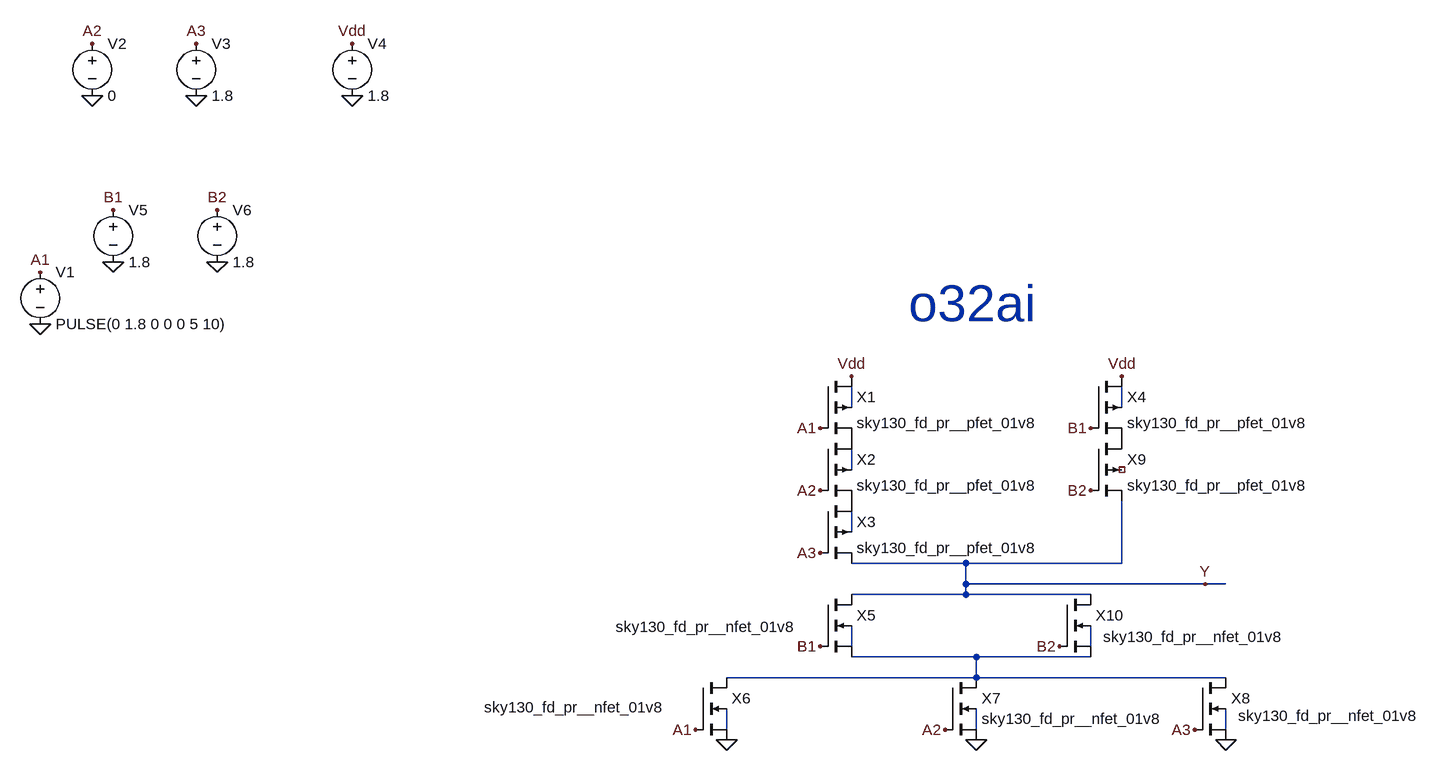
[diagram p0: schematic o32ai.asc]
o32ai.asc, the LTspice schematic file:
Version 4
SHEET 1 1520 892
WIRE 560 320 560 288
WIRE 976 320 976 288
WIRE 560 416 560 384
WIRE 560 512 560 480
WIRE 736 560 560 560
WIRE 976 560 976 464
WIRE 976 560 736 560
WIRE 736 592 736 560
WIRE 1104 592 736 592
WIRE 1136 592 1104 592
WIRE 736 608 736 592
WIRE 736 608 560 608
WIRE 928 608 736 608
WIRE 560 688 560 656
WIRE 928 688 928 656
WIRE 752 704 560 704
WIRE 928 704 752 704
WIRE 752 736 752 704
WIRE 752 736 368 736
WIRE 1136 736 752 736
WIRE 368 816 368 784
WIRE 752 816 752 784
WIRE 1136 816 1136 784
FLAG 560 272 Vdd
FLAG -688 192 0
FLAG -608 -160 0
FLAG -448 -160 0
FLAG -688 112 A1
FLAG -608 -240 A2
FLAG -448 -240 A3
FLAG -208 -240 Vdd
FLAG -208 -160 0
FLAG -576 96 0
FLAG -576 16 B1
FLAG 512 352 A1
FLAG 512 448 A2
FLAG 512 544 A3
FLAG 368 832 0
FLAG 752 832 0
FLAG 1136 832 0
FLAG 320 816 A1
FLAG 704 816 A2
FLAG 1088 816 A3
FLAG 928 352 B1
FLAG 976 272 Vdd
FLAG -416 96 0
FLAG -416 16 B2
FLAG 928 448 B2
FLAG 512 688 B1
FLAG 880 688 B2
FLAG 1104 592 Y
SYMBOL pmos4 512 272 R0
SYMATTR InstName X1
SYMATTR Value2 l=0.13u w=4u
SYMATTR Value sky130_fd_pr__pfet_01v8
SYMBOL pmos4 512 368 R0
SYMATTR InstName X2
SYMATTR Value2 l=0.13u w=4u
SYMATTR Value sky130_fd_pr__pfet_01v8
SYMBOL pmos4 512 464 R0
SYMATTR InstName X3
SYMATTR Value2 l=0.13u w=4u
SYMATTR Value sky130_fd_pr__pfet_01v8
SYMBOL pmos4 928 272 R0
SYMATTR InstName X4
SYMATTR Value2 l=0.13u w=4u
SYMATTR Value sky130_fd_pr__pfet_01v8
SYMBOL voltage -688 96 R0
WINDOW 123 0 0 Left 0
WINDOW 39 0 0 Left 0
SYMATTR InstName V1
SYMATTR Value PULSE(0 1.8 0 0 0 5 10)
SYMBOL voltage -608 -256 R0
WINDOW 123 0 0 Left 0
WINDOW 39 0 0 Left 0
SYMATTR InstName V2
SYMATTR Value 0
SYMBOL voltage -448 -256 R0
WINDOW 123 0 0 Left 0
WINDOW 39 0 0 Left 0
SYMATTR InstName V3
SYMATTR Value 1.8
SYMBOL voltage -208 -256 R0
WINDOW 123 0 0 Left 0
WINDOW 39 0 0 Left 0
SYMATTR InstName V4
SYMATTR Value 1.8
SYMBOL voltage -576 0 R0
WINDOW 123 0 0 Left 0
WINDOW 39 0 0 Left 0
SYMATTR InstName V5
SYMATTR Value 1.8
SYMBOL nmos4 320 736 R0
WINDOW 3 -325 46 Left 2
SYMATTR InstName X6
SYMATTR Value2 l=0.13u w=2u
SYMATTR Value sky130_fd_pr__nfet_01v8
SYMBOL nmos4 704 736 R0
WINDOW 3 56 63 Left 2
SYMATTR InstName X7
SYMATTR Value2 l=0.13u w=2u
SYMATTR Value sky130_fd_pr__nfet_01v8
SYMBOL nmos4 1088 736 R0
WINDOW 3 67 59 Left 2
SYMATTR InstName X8
SYMATTR Value2 l=0.13u w=2u
SYMATTR Value sky130_fd_pr__nfet_01v8
SYMBOL pmos4 928 368 R0
SYMATTR InstName X9
SYMATTR Value2 l=0.13u w=4u
SYMATTR Value sky130_fd_pr__pfet_01v8
SYMBOL voltage -416 0 R0
WINDOW 123 0 0 Left 0
WINDOW 39 0 0 Left 0
SYMATTR InstName V6
SYMATTR Value 1.8
SYMBOL nmos4 512 608 R0
WINDOW 3 -315 50 Left 2
SYMATTR InstName X5
SYMATTR Value2 l=0.13u w=2u
SYMATTR Value sky130_fd_pr__nfet_01v8
SYMBOL nmos4 880 608 R0
WINDOW 3 67 65 Left 2
SYMATTR InstName X10
SYMATTR Value2 l=0.13u w=2u
SYMATTR Value sky130_fd_pr__nfet_01v8
TEXT 648 160 Left 6 ;o32ai

The netlist it stands for:
* o32ai.asc
M§X1 Vdd A1 P001 N001 sky130_fd_pr__pfet_01v8 l=0.13u w=4u
M§X2 P001 A2 P002 N003 sky130_fd_pr__pfet_01v8 l=0.13u w=4u
M§X3 P002 A3 Y N004 sky130_fd_pr__pfet_01v8 l=0.13u w=4u
M§X4 Vdd B1 P003 N002 sky130_fd_pr__pfet_01v8 l=0.13u w=4u
V1 A1 0 PULSE(0 1.8 0 0 0 5 10)
V2 A2 0 0
V3 A3 0 1.8
V4 Vdd 0 1.8
V5 B1 0 1.8
M§X6 N007 A1 0 N008 sky130_fd_pr__nfet_01v8 l=0.13u w=2u
M§X7 N007 A2 0 N009 sky130_fd_pr__nfet_01v8 l=0.13u w=2u
M§X8 N007 A3 0 N010 sky130_fd_pr__nfet_01v8 l=0.13u w=2u
M§X9 P003 B2 Y NC_01 sky130_fd_pr__pfet_01v8 l=0.13u w=4u
V6 B2 0 1.8
M§X5 Y B1 N007 N005 sky130_fd_pr__nfet_01v8 l=0.13u w=2u
M§X10 Y B2 N007 N006 sky130_fd_pr__nfet_01v8 l=0.13u w=2u
.model NMOS NMOS
.model PMOS PMOS
.lib standard.mos
* o32ai
.backanno
.end